# EAGLE design TinyGX (EAGLE 7.2.0)
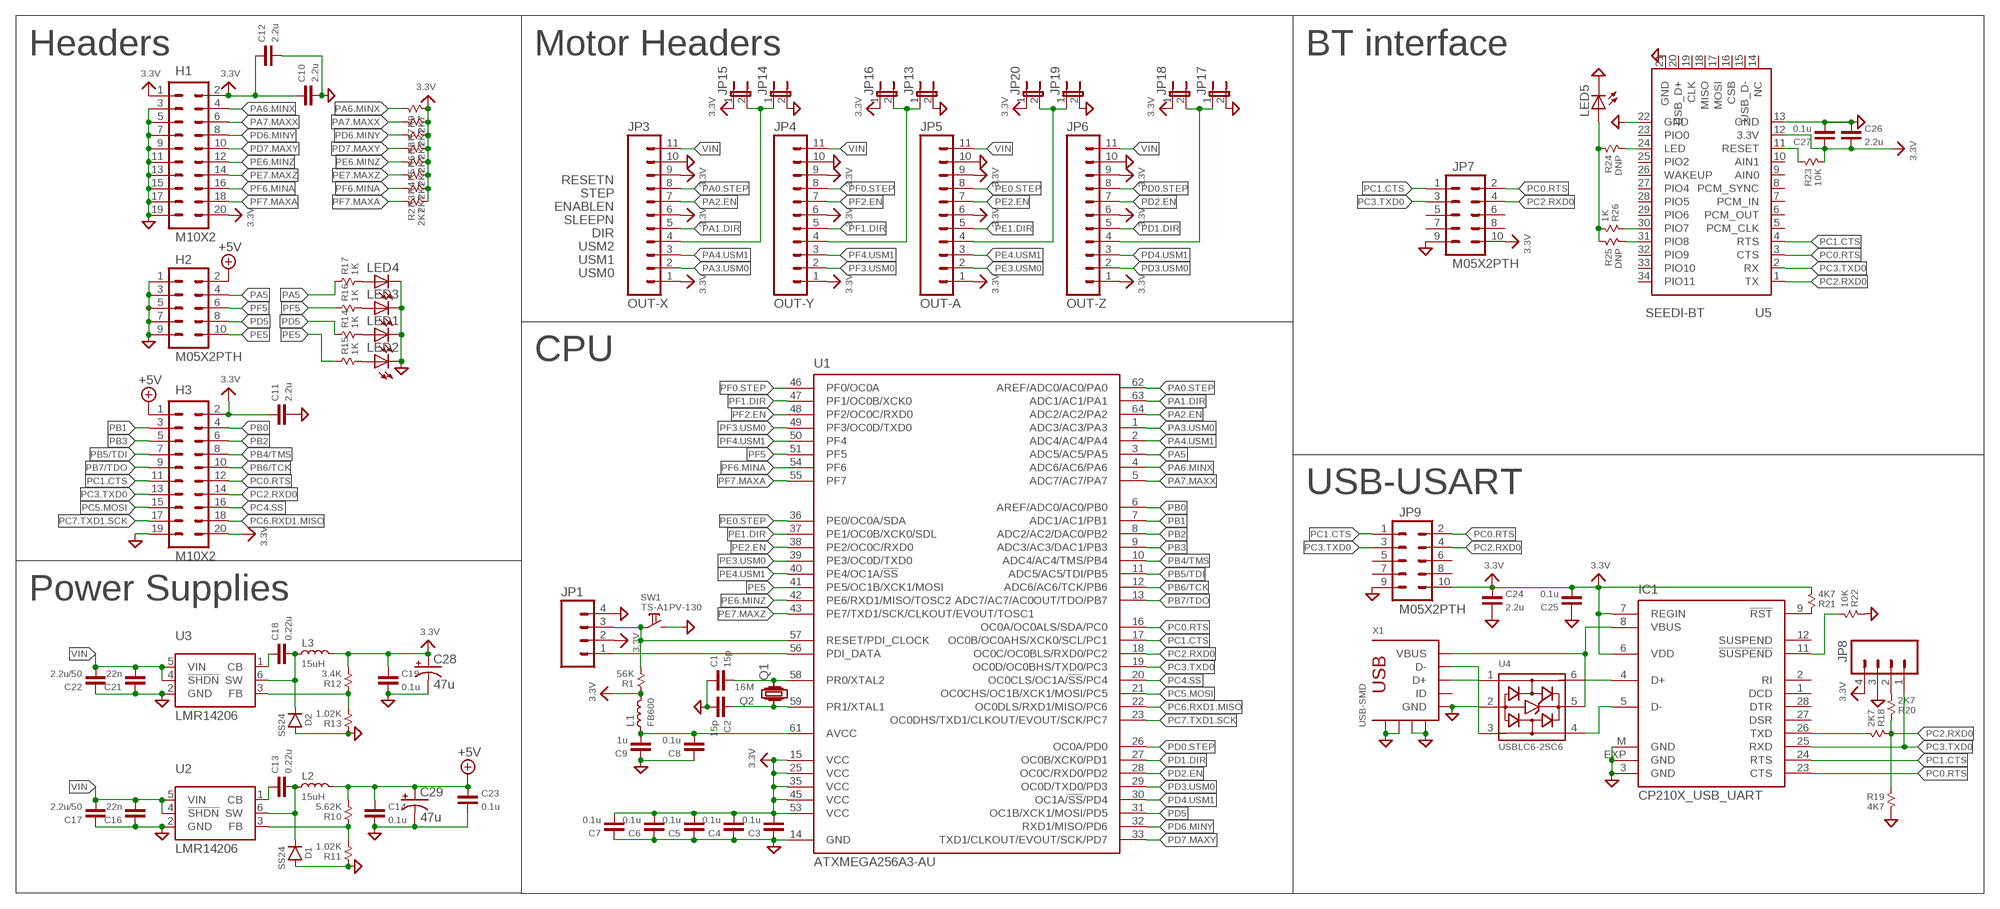
[diagram p0: schematic, sheet 1]

## Parts
C1  15p  CAP-0603  [0603]
C2  15p  CAP-0603  [0603]
C3  0.1u  CAP-0603  [0603]
C4  0.1u  CAP-0603  [0603]
C5  0.1u  CAP-0603  [0603]
C6  0.1u  CAP-0603  [0603]
C7  0.1u  CAP-0603  [0603]
C8  0.1u  CAP-0603  [0603]
C9  1u  CAP-0603  [0603]
C10  2.2u  CAP-0603  [0603]
C11  2.2u  CAP-0603  [0603]
C12  2.2u  CAP-0603  [0603]
C13  0.22u  CAP-0603  [0603]
C14  0.1u  CAP-0603  [0603]
C16  22n  CAP-0603  [0603]
C17  2.2u/50  CAP-1206  [1206]
C18  0.22u  CAP-0603  [0603]
C19  0.1u  CAP-0603  [0603]
C21  22n  CAP-0603  [0603]
C22  2.2u/50  CAP-1206  [1206]
C23  0.1u  CAP-0603  [0603]
C24  2.2u  CAP-0603  [0603]
C25  0.1u  CAP-0603  [0603]
C26  2.2u  CAP-0603  [0603]
C27  0.1u  CAP-0603  [0603]
C28  47u  CPOL-USCT3216  [CT3216]
C29  47u  CPOL-USCT3216  [CT3216]
D1  SS24  DIODE-SMA  [SMA]
D2  SS24  DIODE-SMA  [SMA]
H1  M10X2  [2X10]
H2  M05X2PTH  [AVR_ICSP]
H3  M10X2  [2X10]
IC1  CP210X_USB_UART  [MLP28]
JP1  M04PTH  [1X04]
JP3  OUT-X  M11PTH  [1X11]
JP4  OUT-Y  M11PTH  [1X11]
JP5  OUT-A  M11PTH  [1X11]
JP6  OUT-Z  M11PTH  [1X11]
JP7  M05X2PTH  [AVR_ICSP]
JP8  M04PTH  [1X04]
JP9  M05X2PTH  [AVR_ICSP]
JP13  JUMPER-2SMD-NO  [SJ_2S-NO]
JP14  JUMPER-2SMD-NO  [SJ_2S-NO]
JP15  JUMPER-2SMD-NO  [SJ_2S-NO]
JP16  JUMPER-2SMD-NO  [SJ_2S-NO]
JP17  JUMPER-2SMD-NO  [SJ_2S-NO]
JP18  JUMPER-2SMD-NO  [SJ_2S-NO]
JP19  JUMPER-2SMD-NO  [SJ_2S-NO]
JP20  JUMPER-2SMD-NO  [SJ_2S-NO]
L1  FB600  INDUCTOR-0603  [0603]
L2  15uH  INDUCTOR-CDRH73-  [CDRH73]
L3  15uH  INDUCTOR-CDRH73-  [CDRH73]
LED1  LEDCHIP-LED0603  [CHIP-LED0603]
LED2  LEDCHIP-LED0603  [CHIP-LED0603]
LED3  LEDCHIP-LED0603  [CHIP-LED0603]
LED4  LEDCHIP-LED0603  [CHIP-LED0603]
LED5  LEDCHIP-LED0603  [CHIP-LED0603]
Q1  CRYSTALHC49US  [HC49US]
Q2  16M  CRYSTAL-KX-KT  [KX-KT]
R1  56K  RESISTOR-0603  [0603]
R2  2K7  RESISTOR-0603  [0603]
R3  2K7  RESISTOR-0603  [0603]
R4  2K7  RESISTOR-0603  [0603]
R5  2K7  RESISTOR-0603  [0603]
R6  2K7  RESISTOR-0603  [0603]
R7  2K7  RESISTOR-0603  [0603]
R8  2K7  RESISTOR-0603  [0603]
R9  2K7  RESISTOR-0603  [0603]
R10  5.62K  RESISTOR-0603  [0603]
R11  1.02K  RESISTOR-0603  [0603]
R12  3.4K  RESISTOR-0603  [0603]
R13  1.02K  RESISTOR-0603  [0603]
R14  1K  RESISTOR-0603  [0603]
R15  1K  RESISTOR-0603  [0603]
R16  1K  RESISTOR-0603  [0603]
R17  1K  RESISTOR-0603  [0603]
R18  2K7  RESISTOR-0603  [0603]
R19  4K7  RESISTOR-0603  [0603]
R20  2K7  RESISTOR-0603  [0603]
R21  4K7  RESISTOR-0603  [0603]
R22  10K  RESISTOR-0603  [0603]
R23  10K  RESISTOR-0603  [0603]
R24  DNP  RESISTOR-0603  [0603]
R25  DNP  RESISTOR-0603  [0603]
R26  1K  RESISTOR-0603  [0603]
SW1  TS-A1PV-130  SWITCH-2-TS-A1PV-130  [TS-A1PV-130]
U1  ATXMEGA256A3-AU  [TQFP64-14X14]
U2  LMR14206  [SOT23-6]
U3  LMR14206  [SOT23-6]
U4  USBLC6-2SC6  [SOT23-6]
U5  SEEDI-BT  [SEEDI-BT]
X1  USB-SMD  [USB-MINIB]

## Nets
3.3V: C3.1 C4.1 C5.1 C6.1 C7.1 C10.2 C11.2 C12.2 C19.2 C24.2 C25.1 C26.1 C27.2 C28.+ H1.1 H1.2 H1.20 H3.2 H3.20 IC1.6(VDD) IC1.7(REGIN) JP1.2 JP3.1 JP3.6 JP3.9 JP4.1 JP4.6 JP4.9 JP5.1 JP5.6 JP5.9 JP6.1 JP6.6 JP6.9 JP7.10 JP8.4 JP9.10 JP15.1 JP16.1 JP18.1 JP20.1 L1.2 L3.P$2 R1.1 R2.2 R3.2 R4.2 R5.2 R6.2 R7.2 R8.2 R9.2 R12.2 R21.2 R23.2 U1.15(VCC) U1.25(VCC) U1.35(VCC) U1.45(VCC) U1.53(VCC) U5.12(3.3V)
+5V: C14.2 C23.2 C29.+ H2.2 H3.1 L2.P$2 R10.2
GND: C1.2 C2.1 C3.2 C4.2 C5.2 C6.2 C7.2 C8.2 C9.2 C10.1 C11.1 C12.1 C14.1 C16.2 C17.2 C19.1 C21.2 C22.2 C23.1 C24.1 C25.2 C26.2 C27.1 C28.- C29.- D1.P$2(A) D2.P$2(A) H1.3 H1.5 H1.7 H1.9 H1.11 H1.13 H1.15 H1.17 H1.19 H2.1 H2.3 H2.5 H2.7 H2.9 H3.19 IC1.3(GND) IC1.EXP(GND) IC1.M(GND) JP1.4 JP3.10 JP4.10 JP5.10 JP6.10 JP7.9 JP8.3 JP9.9 JP13.2 JP14.2 JP17.2 JP19.2 LED1.C LED2.C LED3.C LED4.C LED5.C R11.1 R13.1 R19.2 R22.1 SW1.2 U1.14(GND) U2.2(GND) U3.2(GND) U4.2(GND) U5.13(GND) U5.21(GND) U5.22(GND) X1.GND X1.GND@1(GND) X1.GND@2(GND) X1.GND@3(GND) X1.GND@4(GND)
N$1: C1.1 Q1.2 Q2.2 U1.58(PR0/XTAL2)
N$2: C2.2 Q1.1 Q2.1 U1.59(PR1/XTAL1)
N$3: R10.1 R11.2 U2.3(FB)
N$4: LED1.A R14.2
N$5: C13.1 D1.P$1(C) L2.P$1 U2.6(SW)
N$6: R12.1 R13.2 U3.3(FB)
N$7: C13.2 U2.1(CB)
N$8: C8.1 C9.1 L1.1 U1.61(AVCC)
N$9: C18.1 D2.P$1(C) L3.P$1 U3.6(SW)
N$10: C18.2 U3.1(CB)
N$11: LED2.A R15.2
N$12: LED3.A R16.2
N$13: LED4.A R17.2
N$14: IC1.5(D-) U4.4(IO2)
N$15: IC1.4(D+) U4.6(IO1)
N$16: IC1.8(VBUS) U4.5(VBUS) X1.VBUS
N$17: JP8.2 R20.2
N$18: IC1.26(TXD) R18.2
N$19: IC1.9(!RST) R21.1
N$20: U4.3(IO2) X1.D-
N$21: U4.1(IO1) X1.D+
N$22: IC1.11(!SUSPEND) R22.2
N$23: JP3.4 JP14.1 JP15.2
N$24: JP4.4 JP13.1 JP16.2
N$25: JP5.4 JP19.1 JP20.2
N$26: JP6.4 JP17.1 JP18.2
N$27: R26.1 U5.30(PIO7)
N$31: R23.1 U5.11(RESET)
N$32: R24.2 U5.24(LED)
N$33: R25.2 U5.31(PIO8)
N$34: LED5.A R24.1 R25.1 R26.2
PA0.STEP: JP3.8 U1.62(AREF/ADC0/AC0/PA0)
PA1.DIR: JP3.5 U1.63(ADC1/AC1/PA1)
PA2.EN: JP3.7 U1.64(ADC2/AC2/PA2)
PA3.USM0: JP3.2 U1.1(ADC3/AC3/PA3)
PA4.USM1: JP3.3 U1.2(ADC4/AC4/PA4)
PA5: H2.4 R17.1 U1.3(ADC5/AC5/PA5)
PA6.MINX: H1.4 R9.1 U1.4(ADC6/AC6/PA6)
PA7.MAXX: H1.6 R7.1 U1.5(ADC7/AC7/PA7)
PB0: H3.4 U1.6(AREF/ADC0/AC0/PB0)
PB1: H3.3 U1.7(ADC1/AC1/PB1)
PB2: H3.6 U1.8(ADC2/AC2/DAC0/PB2)
PB3: H3.5 U1.9(ADC3/AC3/DAC1/PB3)
PB4/TMS: H3.8 U1.10(ADC4/AC4/TMS/PB4)
PB5/TDI: H3.7 U1.11(ADC5/AC5/TDI/PB5)
PB6/TCK: H3.10 U1.12(ADC6/AC6/TCK/PB6)
PB7/TDO: H3.9 U1.13(ADC7/AC7/AC0OUT/TDO/PB7)
PC0.RTS: H3.12 IC1.23(CTS) JP7.2 JP9.2 U1.16(OC0A/OC0ALS/SDA/PC0) U5.3(CTS)
PC1.CTS: H3.11 IC1.24(RTS) JP7.1 JP9.1 U1.17(OC0B/OC0AHS/XCK0/SCL/PC1) U5.4(RTS)
PC2.RXD0: H3.14 JP7.4 JP9.4 R18.1 R19.1 R20.1 U1.18(OC0C/OC0BLS/RXD0/PC2) U5.1(TX)
PC3.TXD0: H3.13 IC1.25(RXD) JP7.3 JP8.1 JP9.3 U1.19(OC0D/OC0BHS/TXD0/PC3) U5.2(RX)
PC4.SS: H3.16 U1.20(OC0CLS/OC1A/!SS!/PC4)
PC5.MOSI: H3.15 U1.21(OC0CHS/OC1B/XCK1/MOSI/PC5)
PC6.RXD1.MISO: H3.18 U1.22(OC0DLS/RXD1/MISO/PC6)
PC7.TXD1.SCK: H3.17 U1.23(OC0DHS/TXD1/CLKOUT/EVOUT/SCK/PC7)
PD0.STEP: JP6.8 U1.26(OC0A/PD0)
PD1.DIR: JP6.5 U1.27(OC0B/XCK0/PD1)
PD2.EN: JP6.7 U1.28(OC0C/RXD0/PD2)
PD3.USM0: JP6.2 U1.29(OC0D/TXD0/PD3)
PD4.USM1: JP6.3 U1.30(OC1A/!SS!/PD4)
PD5: H2.8 R14.1 U1.31(OC1B/XCK1/MOSI/PD5)
PD6.MINY: H1.8 R8.1 U1.32(RXD1/MISO/PD6)
PD7.MAXY: H1.10 R6.1 U1.33(TXD1/CLKOUT/EVOUT/SCK/PD7)
PDI: JP1.1 U1.56(PDI_DATA)
PE0.STEP: JP5.8 U1.36(PE0/OC0A/SDA)
PE1.DIR: JP5.5 U1.37(PE1/OC0B/XCK0/SDL)
PE2.EN: JP5.7 U1.38(PE2/OC0C/RXD0)
PE3.USM0: JP5.2 U1.39(PE3/OC0D/TXD0)
PE4.USM1: JP5.3 U1.40(PE4/OC1A/!SS)
PE5: H2.10 R15.1 U1.41(PE5/OC1B/XCK1/MOSI)
PE6.MINZ: H1.12 R5.1 U1.42(PE6/RXD1/MISO/TOSC2)
PE7.MAXZ: H1.14 R4.1 U1.43(PE7/TXD1/SCK/CLKOUT/EVOUT/TOSC1)
PF0.STEP: JP4.8 U1.46(PF0/OC0A)
PF1.DIR: JP4.5 U1.47(PF1/OC0B/XCK0)
PF2.EN: JP4.7 U1.48(PF2/OC0C/RXD0)
PF3.USM0: JP4.2 U1.49(PF3/OC0D/TXD0)
PF4.USM1: JP4.3 U1.50(PF4)
PF5: H2.6 R16.1 U1.51(PF5)
PF6.MINA: H1.16 R3.1 U1.54(PF6)
PF7.MAXA: H1.18 R2.1 U1.55(PF7)
RST/PDC: JP1.3 R1.2 SW1.1 U1.57(RESET/PDI_CLOCK)
VIN: C16.1 C17.1 C21.1 C22.1 JP3.11 JP4.11 JP5.11 JP6.11 U2.4(!SHDN) U2.5(VIN) U3.4(!SHDN) U3.5(VIN)
Unconnected: IC1.1(DCD) IC1.2(RI) IC1.12(SUSPEND) IC1.27(DSR) IC1.28(DTR) JP7.5 JP7.6 JP7.7 JP7.8 JP9.5 JP9.6 JP9.7 JP9.8 U5.5(PCM_CLK) U5.6(PCM_OUT) U5.7(PCM_IN) U5.8(PCM_SYNC) U5.9(AIN0) U5.10(AIN1) U5.14(NC) U5.15(USB_D-) U5.16(CSB) U5.17(MOSI) U5.18(MISO) U5.19(CLK) U5.20(USB_D+) U5.23(PIO0) U5.25(PIO2) U5.26(WAKEUP) U5.27(PIO4) U5.28(PIO5) U5.29(PIO6) U5.32(PIO9) U5.33(PIO10) U5.34(PIO11) X1.ID

## Notes on the sheet
- Headers | Motor Headers | BT interface
- RESETN
- STEP
- ENABLEN
- SLEEPN
- DIR
- USM2
- USM1
- USM0
- CPU
- USB-USART
- Power Supplies

## Power pins joined to a net without a drawn wire
GND: U1.24(GND) U1.34(GND) U1.44(GND) U1.52(GND) U1.60(GND)

## Library data of the parts
C1-C14 C16-C19 C21-C27 = X893:CAP: Capacitor
C28 C29 = adafruit:CPOL-US: POLARIZED CAPACITOR, American symbol
D1 D2 = X893:DIODE
H1 H3 = SparkFun:M10X2: This was SPECIALLY designed to be used with our Graphic LCD Backpack. Be sure you want to use this! It is not only staggered on each line of header holes, but IT IS ALSO offset of the center point of the top and bottom lines by 5 mil. This causes the headers to lock into place on the "standard" footprint on the LCD screen. The extra squares on the tdocu layer are there simply to reference other pins (if you were to actually populate a longer header than ten long - this is what we do with the backpacks).
H2 JP7 JP9 = SparkFun:M05X2: Header 5x2 Standard 10-pin dual row 0.1" header. Commonly used with AVR-ISP. Use with Spark Fun Electronics SKU: PRT-00778
IC1 = SparkFun:CP210X_USB_UART: Single-Chip USB to UART Bridge Source: www.silabs.com .. CP2101.pdf / cp2102.pdf. Spark Fun Electronics SKU : COM-00310
JP1 JP8 = SparkFun:M04: Header 4 Standard 4-pin 0.1" header. Use with straight break away headers (SKU : PRT-00116), right angle break away headers (PRT-00553), swiss pins (PRT-00743), machine pins (PRT-00117), and female headers (PRT-00115). Molex polarized connector foot print use with SKU : PRT-08231 with associated crimp pins and housings.
JP3-JP6 = SparkFun:M11: Header 11 Standard 11-pin 0.1" header. Use with straight break away headers (SKU : PRT-00116), right angle break away headers (PRT-00553), swiss pins (PRT-00743), machine pins (PRT-00117), and female headers (PRT-00115).
JP13-JP20 = SparkFun:JUMPER-2: Jumper Basic 0.1" spaced jumper. Use with breakaway headers.
L1-L3 = X893:INDUCTOR: http://www.murata.com/products/catalog/pdf/o05e.pdf
LED1-LED5 = led:LED: LED OSRAM: - CHIPLED LG R971, LG N971, LY N971, LG Q971, LY Q971, LO R971, LY R971 LH N974, LH R974 LS Q976, LO Q976, LY Q976 LO Q996 - Hyper CHIPLED LW Q18S LB Q993, LB Q99A, LB R99A - SideLED LS A670, LO A670, LY A670, LG A670, LP A670 LB A673, LV A673, LT A673, LW A673 LH A674 LY A675 LS A676, LA A676, LO A676, LY A676, LW A676 LS A679, LY A679, LG A679 - Hyper Micro SIDELED® LS Y876, LA Y876, LO Y876, LY Y876 LT Y87S - SmartLED LW L88C, LW L88S LB L89C, LB L89S, LG L890 LS L89K, LO L89K, LY L89K LS L896, LA L896, LO L896, LY L896 - TOPLED LS T670, LO T670, LY T670, LG T670, LP T670 LSG T670, LSP T670, LSY T670, LOP T670, LYG T670 LG T671, LOG T671, LSG T671 LB T673, LV T673, LT T673, LW T673 LH T674 LS T676, LA T676, LO T676, LY T676, LB T676, LH T676, LSB T676, LW T676 LB T67C, LV T67C, LT T67C, LS T67K, LO T67K, LY T67K, LW E67C LS E67B, LA E67B, LO E67B, LY E67B, LB E67C, LV E67C, LT E67C LW T67C LS T679, LY T679, LG T679 LS T770, LO T770, LY T770, LG T770, LP T770 LB T773, LV T773, LT T773, LW T773 LH T774 LS E675, LA E675, LY E675, LS T675 LS T776, LA T776, LO T776, LY T776, LB T776 LHGB T686 LT T68C, LB T68C - Hyper Mini TOPLED® LB M676 - Mini TOPLED Santana® LG M470 LS M47K, LO M47K, LY M47K Source: http://www.osram.convergy.de LUXEON: - LUMILED® LXK2-PW12-R00, LXK2-PW12-S00, LXK2-PW14-U00, LXK2-PW14-V00 LXK2-PM12-R00, LXK2-PM12-S00, LXK2-PM14-U00 LXK2-PE12-Q00, LXK2-PE12-R00, LXK2-PE12-S00, LXK2-PE14-T00, LXK2-PE14-U00 LXK2-PB12-K00, LXK2-PB12-L00, LXK2-PB12-M00, LXK2-PB14-N00, LXK2-PB14-P00, LXK2-PB14-Q00 LXK2-PR12-L00, LXK2-PR12-M00, LXK2-PR14-Q00, LXK2-PR14-R00 LXK2-PD12-Q00, LXK2-PD12-R00, LXK2-PD12-S00 LXK2-PH12-R00, LXK2-PH12-S00 LXK2-PL12-P00, LXK2-PL12-Q00, LXK2-PL12-R00 Source: www.luxeon.com KINGBRIGHT: KA-3528ASYC Source: www.kingbright.com
Q1 = SparkFun:CRYSTAL: Crystals Various standard crystals. Proven footprints. Spark Fun Electronics SKU : COM-00534
Q2 = X893:CRYSTAL: Crystal
R1-R26 = X893:RESISTOR
SW1 = X893:SWITCH-2: KSR http://www.farnell.com/datasheets/320571.pdf
U1 = X893:ATXMEGA
U2 U3 = X893:LMR14206: SIMPLE SWITCHER 42Vin, 0.6A Step-Down Voltage Regulator in SOT-23 www.ti.com/lit/ds/symlink/lmr14206.pdf
U4 = X893:USBLC6: USBLC6-2SC6 <http://www.terraelectronica.ru/pdf/ST/USBLC6-2SC6.pdf>
U5 = X893:SEEDI-BT: Serial port bluetooth module http://www.seeedstudio.com/depot/serial-port-bluetooth-module-masterslave-p-572.html?cPath=2
X1 = X893:USB: USB Connectors USB-B-PTH is fully proven SKU : PRT-00139 USB-miniB is fully proven SKU : PRT-00587 USB-A-PCB is untested. USB-A-H is throughly reviewed, but untested. Spark Fun Electronics SKU : PRT-00437 USB-B-SMT is throughly reviewed, but untested. Needs silkscreen touching up. USB-A-S has not been used/tested USB-MB-H has not been used/tested

## Board
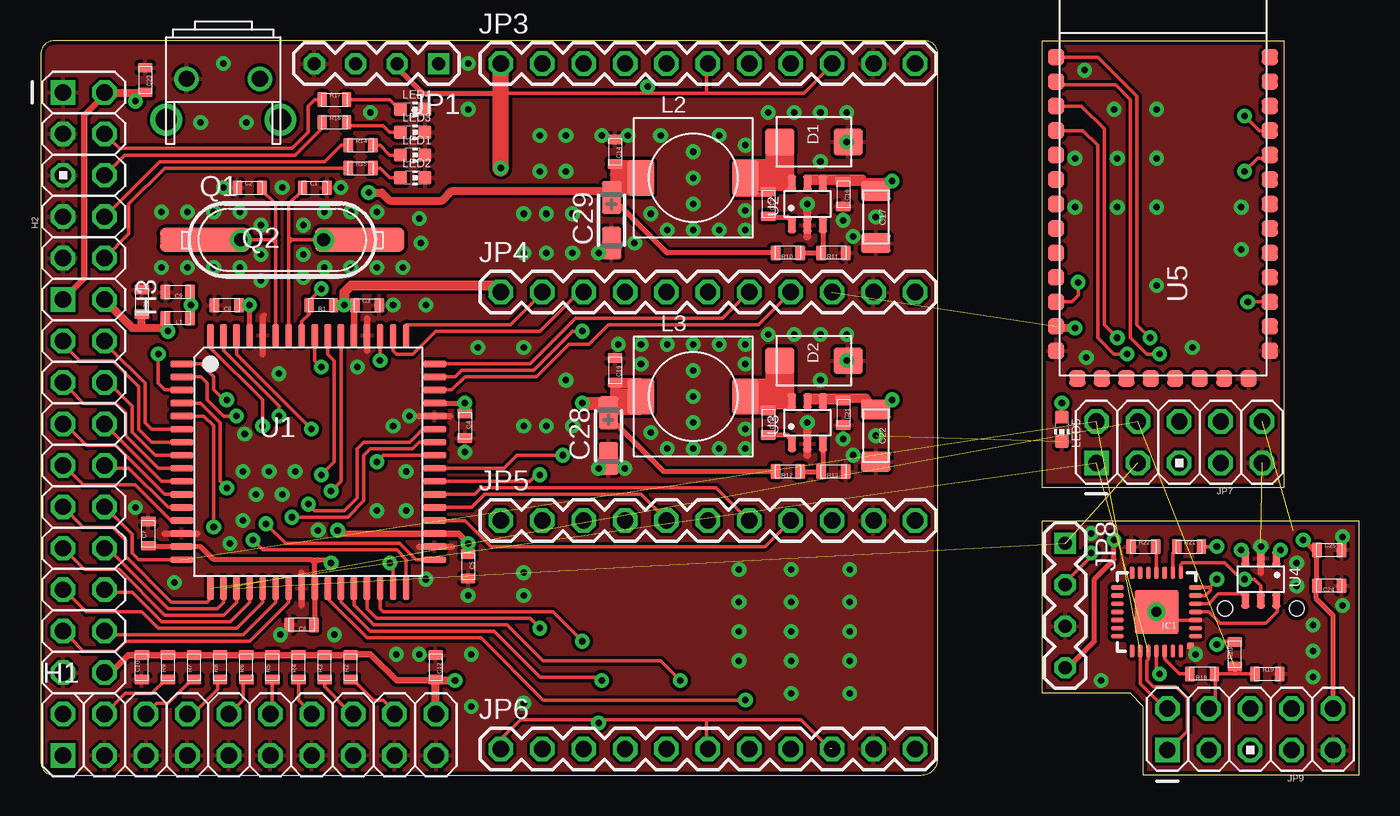
[diagram p1: board, top side]
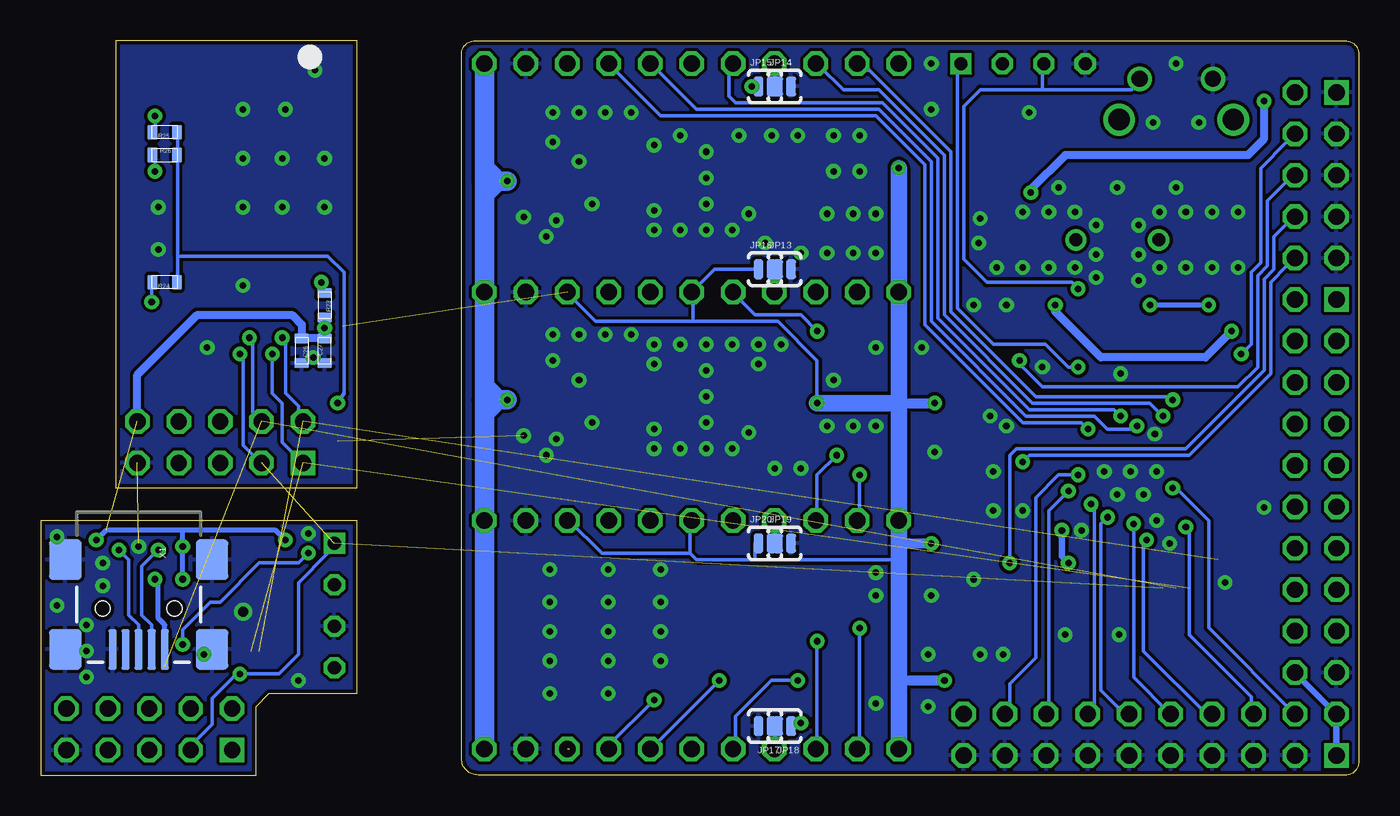
[diagram p2: board, bottom side, seen from below]

Size 80.8 x 45 mm. Coordinates in mm from the lower left corner, seen from the top.
Outline: 0,0.8 arc90 0.8,0 54,0 arc90 55,1 55,44.2 arc90 54.2,45 0.8,45 arc90 0,44.2 0,0.8
Outline: 80.8,0 67.6,0 67.6,4.2 66.8,5 61.4,5 61.4,15.6 80.8,15.6 80.8,0
Outline: 76.2,17.6 61.4,17.6 61.4,45 76.2,45 76.2,17.6
Copper layers (1+16): Top 0.035mm / dielectric 1.5mm / Bottom 0.035mm
Design rules "Rezonit": minimum track width 0.2mm, minimum drill 0.4mm, track to track 0.2mm, track to pad 0.2mm, pad to pad 0.2mm, via to via 0.2mm, smd to smd 0mil, copper to edge 0.25mm, drill to drill 0.4mm, minimum pad ring 0.25mm, minimum via ring 0.25mm, stop-mask expansion 4mil, vias tented up to drill 0.4mm, thermal gap 0.2mm

### Footprints (pad centres in the part's own frame; a part is rotated, then mirrored left to right if it is on the bottom)
0603 = smd 0.6 x 0.9: 1 -0.75,0; 2 0.75,0
1206 = smd 1.2 x 1.8: 1 -1.6,0; 2 1.6,0
CT3216 = smd 2 x 1.2: + 1.4,0; - -1.4,0
SMA = smd 1.8 x 1.65: P$1 2.1,0; P$2 -2.1,0
2X10 = drill 1 pad 1.5 square: 1 -11.43,-1.27 | drill 1 pad 1.5 octagon: 2 -11.43,1.27; 3 -8.89,-1.27; 4 -8.89,1.27; 5 -6.35,-1.27; 6 -6.35,1.27; 7 -3.81,-1.27; 8 -3.81,1.27; 9 -1.27,-1.27; 10 -1.27,1.27; 11 1.27,-1.27; 12 1.27,1.27; 13 3.81,-1.27; 14 3.81,1.27; 15 6.35,-1.27; 16 6.35,1.27; 17 8.89,-1.27; 18 8.89,1.27; 19 11.43,-1.27; 20 11.43,1.27
AVR_ICSP = drill 1 pad 1.5 square: 1 -1.27,5.08 | drill 1 pad 1.5 octagon: 2 1.27,5.08; 3 -1.27,2.54; 4 1.27,2.54; 5 -1.27,0; 6 1.27,0; 7 -1.27,-2.54; 8 1.27,-2.54; 9 -1.27,-5.08; 10 1.27,-5.08
MLP28 = smd 0.8 x 0.3: 1 -2.4,1.5; 2 -2.4,1; 3 -2.4,0.5; 4 -2.4,0; 5 -2.4,-0.5; 6 -2.4,-1; 7 -2.4,-1.5; 15 2.4,-1.5; 16 2.4,-1; 17 2.4,-0.5; 18 2.4,0; 19 2.4,0.5; 20 2.4,1; 21 2.4,1.5 | smd 0.3 x 0.8: 8 -1.5,-2.4; 9 -1,-2.4; 10 -0.5,-2.4; 11 0,-2.4; 12 0.5,-2.4; 13 1,-2.4; 14 1.5,-2.4; 22 1.5,2.4; 23 1,2.4; 24 0.5,2.4; 25 0,2.4; 26 -0.5,2.4; 27 -1,2.4; 28 -1.5,2.4 | smd 2.7 x 2.7: EXP 0,0 | smd 0.435 x 0.435: M -2.103,2.103
1X04 = drill 0.8 pad 1.3 square: 1 0,0 | drill 0.8 pad 1.3 octagon: 2 2.54,0; 3 5.08,0; 4 7.62,0
1X11 = drill 1 pad 1.5 octagon: 1 0,0; 2 2.54,0; 3 5.08,0; 4 7.62,0; 5 10.16,0; 6 12.7,0; 7 15.24,0; 8 17.78,0; 9 20.32,0; 10 22.86,0; 11 25.4,0
SJ_2S-NO = smd 0.6 x 1.2: 1 -0.4,0; 2 0.4,0
CDRH73 = smd 2.2 x 1.6: P$1 0,3.2; P$2 0,-3.2
CHIP-LED0603 = smd 0.8 x 0.8: A 0,-0.75; C 0,0.75
HC49US = drill 0.813: 1 -2.54,0; 2 2.54,0
KX-KT = smd 5.5 x 1.5: 1 -4.75,0; 2 4.75,0
TS-A1PV-130 = drill 1: 1 -2.25,0; 2 2.25,0 | drill 1.3: GND@1 3.5,2.5; GND@2 -3.5,2.5
TQFP64-14X14 = smd 1.4 x 0.4: 1 -7.75,6; 2 -7.75,5.2; 3 -7.75,4.4; 4 -7.75,3.6; 5 -7.75,2.8; 6 -7.75,2; 7 -7.75,1.2; 8 -7.75,0.4; 9 -7.75,-0.4; 10 -7.75,-1.2; 11 -7.75,-2; 12 -7.75,-2.8; 13 -7.75,-3.6; 14 -7.75,-4.4; 15 -7.75,-5.2; 16 -7.75,-6; 33 7.75,-6; 34 7.75,-5.2; 35 7.75,-4.4; 36 7.75,-3.6; 37 7.75,-2.8; 38 7.75,-2; 39 7.75,-1.2; 40 7.75,-0.4; 41 7.75,0.4; 42 7.75,1.2; 43 7.75,2; 44 7.75,2.8; 45 7.75,3.6; 46 7.75,4.4; 47 7.75,5.2; 48 7.75,6 | smd 0.4 x 1.4: 17 -6,-7.75; 18 -5.2,-7.75; 19 -4.4,-7.75; 20 -3.6,-7.75; 21 -2.8,-7.75; 22 -2,-7.75; 23 -1.2,-7.75; 24 -0.4,-7.75; 25 0.4,-7.75; 26 1.2,-7.75; 27 2,-7.75; 28 2.8,-7.75; 29 3.6,-7.75; 30 4.4,-7.75; 31 5.2,-7.75; 32 6,-7.75; 49 6,7.75; 50 5.2,7.75; 51 4.4,7.75; 52 3.6,7.75; 53 2.8,7.75; 54 2,7.75; 55 1.2,7.75; 56 0.4,7.75; 57 -0.4,7.75; 58 -1.2,7.75; 59 -2,7.75; 60 -2.8,7.75; 61 -3.6,7.75; 62 -4.4,7.75; 63 -5.2,7.75; 64 -6,7.75
SOT23-6 = smd 1 x 0.5: 1 -1.3,0.95; 2 -1.3,0; 3 -1.3,-0.95; 4 1.3,-0.95; 5 1.3,0; 6 1.3,0.95
SEEDI-BT = smd 1 x 1: 1 -6.55,6; 2 -6.55,4.5; 3 -6.55,3; 4 -6.55,1.5; 5 -6.55,0; 6 -6.55,-1.5; 7 -6.55,-3; 8 -6.55,-4.5; 9 -6.55,-6; 10 -6.55,-7.5; 11 -6.55,-9; 12 -6.55,-10.5; 13 -6.55,-12; 14 -5.25,-13.7; 15 -3.75,-13.7; 16 -2.25,-13.7; 17 -0.75,-13.7; 18 0.75,-13.7; 19 2.25,-13.7; 20 3.75,-13.7; 21 5.25,-13.7; 22 6.55,-12; 23 6.55,-10.5; 24 6.55,-9; 25 6.55,-7.5; 26 6.55,-6; 27 6.55,-4.5; 28 6.55,-3; 29 6.55,-1.5; 30 6.55,0; 31 6.55,1.5; 32 6.55,3; 33 6.55,4.5; 34 6.55,6
USB-MINIB = smd 2.5 x 0.5: D+ 2.5,0; D- 2.5,0.8; GND 2.5,-1.6; ID 2.5,-0.8; VBUS 2.5,1.6 | smd 2.5 x 2: GND@1 -3,-4.5; GND@2 -3,4.5; GND@3 2.5,4.5; GND@4 2.5,-4.5 | hole 0.9: 0,2.2; 0,-2.2

### Placement (x,y rotation side)
C1  16.8,36 0 top
C2  12.8,36 0 top
C3  20,28.8 0 top
C4  26,21.4 270 top
C5  26.2,12.8 270 top
C6  16,9.2 180 top
C7  6.6,14.8 90 top
C8  11.4,28.8 180 top
C9  8.4,29.6 180 top
C10  6.2,6.6 90 top
C11  6.2,29 270 top
C12  24.2,6.6 270 top
C13  44.6,35 270 top
C14  35.2,38.2 270 top
C16  49.2,35.6 270 top
C17  51.2,34.2 270 top
C18  44.6,21.6 270 top
C19  35.2,24.8 270 top
C21  49.2,22.2 270 top
C22  51.2,20.8 270 top
C23  6.4,42.6 270 top
C24  79,11.6 180 top
C25  79,13.8 0 top
C26  64.8,26 270 bottom
C27  63.4,26 90 bottom
C28  34.8,20.8 90 top
C29  35,34 90 top
D1  47.4,38.8 180 top
D2  47.4,25.4 180 top
H1  12.8,2.47 0 top
H2  2.64,36.76 0 top
H3  2.64,17.71 270 top
IC1  68.4,10 180 top
JP1  24.39,43.6 180 top
JP3  28.2,43.6 0 top
JP4  28.2,29.6 0 top
JP5  28.2,15.6 0 top
JP6  28.2,1.6 0 top
JP7  69.8,20.4 90 top
JP8  62.8,14.2 270 top
JP9  74.15,2.8 90 top
JP13  35.2,31 0 bottom
JP14  35.2,42.2 0 bottom
JP15  36.4,42.2 0 bottom
JP16  36.4,31 0 bottom
JP17  36.4,3 180 bottom
JP18  35.2,3 180 bottom
JP19  35.2,14.2 0 bottom
JP20  36.4,14.2 0 bottom
L1  8.4,28 180 top
L2  40,36.6 270 top
L3  40,23.2 270 top
LED1  22.8,38 270 top
LED2  22.8,36.6 270 top
LED3  22.8,39.4 270 top
LED4  22.8,40.8 270 top
LED5  62.6,21.2 180 top
Q1  14.8,32.8 0 top
Q2  14.8,32.8 0 top
R1  17.2,28.8 180 top
R2  19,6.6 90 top
R3  17.4,6.6 90 top
R4  15.8,6.6 90 top
R5  14.2,6.6 90 top
R6  12.6,6.6 90 top
R7  9.4,6.6 90 top
R8  11,6.6 90 top
R9  7.8,6.6 90 top
R10  45.8,32 180 top
R11  48.6,32 180 top
R12  45.8,18.6 180 top
R13  48.6,18.6 180 top
R14  19.6,38.6 0 top
R15  19.6,37.2 0 top
R16  18,40 0 top
R17  18,41.4 0 top
R18  71.2,6.2 180 top
R19  75.2,6.2 0 top
R20  73.2,7.4 90 top
R21  70.4,14 0 top
R22  67.6,14 0 top
R23  63.4,28.8 270 bottom
R24  73.2,30.2 180 bottom
R25  73.2,39.4 180 bottom
R26  73.2,38 0 bottom
SW1  11.19,42.67 180 top
U1  16.4,19.2 0 top
U2  47,35 90 top
U3  47,21.6 90 top
U4  74.8,12 270 top
U5  68.8,38 0 top
X1  74.8,10.2 270 bottom

### Tracks (layer width: path | path; a pad name or v marks a point on that pad's centre or on a via)
3.3V  (via drill 0.4)  (3 unrouted)
  Top 0.2: R1.1 v18.6,28.8 C3.1 | 40.8,41.8 46.8,41.8 48.18,43.18 48.18,43.26 JP3.9 | 40.8,41.8 37.2,41.8 | 37.2,41.8 28.2,41.8 | 40.8,41.8 40.8,43.5 JP3.6 | 48.38,1.62 46.6,3.4 40.8,3.4 | 40.8,3.4 34.2,3.4 | 34.2,3.4 29.4,3.4 28.2,2.2 JP6.1 | 40.8,3.4 40.8,1.8 40.9,1.7 JP6.6 | 7.6,28 7.6,27.4 | IC1.6 71.4,11 71.7,11.3 71.7,11.5 | IC1.7 71.7,11.5 | 71.7,11.5 v72.1,12 | R21.2 v72.1,14 | 35,22.2 C28.+ | v37.2,42.2 37.2,41.8 | v34.2,3.2 34.2,3.4
  Top 0.3: U1.45 v26,22.8 C4.1 | C6.1 16.8,9.2 U1.25 16.8,13 | 6.6,14 U1.15 9.8,14 10.6,13.2 16.6,13.2 | 16.8,13 16.6,13.2 | 16.8,13 17,13.2 | 16.6,13.2 17.6,13.2 v17.8,13 | C11.2 6.2,28.2 | L1.2 7.6,28 | R12.2 38.2,18.6 35.2,21.6 35.2,22 35,22.2 | JP1.2 21.85,43.35 23.4,41.8 28.2,41.8 | JP9.10 79.23,9.77 78.2,10.8 78.2,11.6 | C24.2 78.2,11.6 | C25.1 78.2,13.8 | 78.2,13.8 78.2,11.6 | 78.2,13.8 78,13.8 v77.4,14.4 | JP8.4 63.01,6.61 64.6,8.2 64.6,12 65.8,13.2 v65.8,14.4
  Top 0.4: C5.1 v26.2,14.2 25.6,14.8 U1.35 18.4,14.8 v18.2,15 | 6.6,14 C7.1 | H3.20 4.03,6.4 4.4,6.4 5.35,7.35 C10.2 R9.2 R7.2 R8.2 R6.2 R5.2 R4.2 R3.2 R2.2 19,7.4 20.2,7.4 21.8,5.8 24.2,5.8 | U1.53 19.2,28.75 C3.1
  Top 0.5: H1.20 24.23,3.83 24.2,4.1 24.2,5.8 v25.4,5.8 | H3.2 3.91,29.09 5.6,27.4 6.2,27.4 | 6.2,27.4 C11.2 | 6.2,27.4 7.6,27.4 v7.8,27.2 | U5.12 62.3,27.5 62.4,27.4 v63.4,27.4
  Top 0.6: JP4.1 28.2,30 19,30 18.6,29.6 v18.6,28.8 | C12.2 24.2,5.8 | C19.2 35.2,24 | 35.2,24 35.2,23.4 | 35.2,23.4 35.2,22.8 | 35.2,22.8 35.2,22.4 36.8,22.4 L3.P$2 | L3.P$2 36.8,24 35.2,24 | 35.2,23.4 36.8,23.4 L3.P$2 | 35.2,22.8 36.4,22.8
  Top 0.8: v33.2,22.8 34.8,22.8 | 34.8,22.8 35.2,22.8 | C28.+ 34.8,22.8
  Top 1: JP3.1 28.2,41.8 v28.2,37.2
  Bottom 0.2: 40.8,27.8 46.8,27.8 48.52,29.52 JP4.9 | 40.8,27.8 35.6,27.8 33.2,25.4 v33.2,22.8 | 40.8,27.8 40.8,29.4 40.9,29.5 JP4.6 39.5,31 JP16.1 | 41,13.6 46.4,13.6 48.4,15.6 JP5.9 | 41,13.6 40.6,13.2 37,13.2 | 37,13.2 28.2,13.2 | 41,13.6 41,15.5 JP5.6 | JP15.1 v37.2,42.2 | JP20.1 37,14.2 37,13.2 | JP18.1 34.6,3 34.6,3.2 v34.2,3.2
  Bottom 0.3: v72.1,12 v72.1,14 72.1,14.9 72,15 | v77.4,14.4 76.8,15 72,15 | v65.8,14.4 66.4,15 72,15
  Bottom 0.4: 4,6.37 H3.20 H1.2 H1.1 | v18.2,15 18.2,13.4 v17.8,13
  Bottom 0.5: v7.8,27.2 9.4,25.6 15.8,25.6 18.6,28.4 v18.6,28.8 | R23.2 v63.4,27.4 C27.2 63.25,26.8 64.8,26.8 C26.1 64.8,27.6 65.4,28.2 71.2,28.2 74.88,24.52 JP7.10
  Bottom 0.6: 28.2,22.8 v26,22.8 | 28.2,5.8 v25.4,5.8 | 28.2,14.2 v26.2,14.2
  Bottom 1: 28.2,22.8 JP4.1 v28.2,37.2 | 28.2,22.8 JP5.1 28.2,14.2 28.2,13.2 28.2,5.8 JP6.1 | 28.2,22.8 v33.2,22.8
+5V  (via drill 0.4)
  Top 0.2: 35.2,35.2 35,35.2 C29.+
  Top 0.3: R10.2 38.4,32 35.2,35.2
  Top 0.4: H3.1 1.37,29.17 2.65,30.45 2.65,40.45 3.6,41.4 3.6,41.53 H2.2
  Top 0.5: v5.8,41.3 5.8,41.8 | v20.1,35.7 20.9,35.7 21.4,35.2 24.6,35.2 25.2,35.8 35,35.8 35,35.7 | C23.2 6.4,41.8 5.8,41.8 | 5.8,41.8 3.95,41.8 H2.2
  Top 0.6: 35,35.7 C29.+ 35,36 35.2,36 | C14.2 35.2,37.4 | 35.2,37.4 35.2,36.8 | 35.2,36.2 35.2,36 | L2.P$2 36.8,35.8 35.2,35.8 35.2,36 | 35.2,37.4 36.4,37.4 36.4,36.8 35.2,36.8 | 35.2,36.8 35.2,36.2 | 35.2,36.2 36.4,36.2
  Bottom 0.5: v5.8,41.3 5.8,39 6.8,38 18,38 20.1,35.9 v20.1,35.7
GND  (via drill 0.4, 0.6)  (2 unrouted)
  Top 0.2: IC1.3 68.9,9.5 IC1.EXP
  Top 0.3: 13.7,28.2 13.6,28.1
  Top 0.4: 13.6,28.1 13.6,25.8 | 7.6,14.8 9.6,14.8 | 16,10.4 16,12.4 | 25.2,14 23.2,14 | 25.1,22 23.2,22 | 20,28 20,26 | 74.8,12.4 74.8,14.2
  Top 0.5: 47,33 v47,35 | 47,19.6 v47,21.6
  other vias: 13.5,33.7 16.1,33.7 13.5,31.9 16.1,31.9 5.8,16.4 18,8.6 8.2,11.8 21.8,7.4 23.2,7.4 26.4,7.4 26.4,4.2 14.6,24.6 16.1,30.5 13.5,30.3 19.4,25 22.6,22 22.4,18.6 14.7,8.6 19,31.1 20.6,31.1 22.2,31.1 23.3,32.6 17.4,31.1 23.2,34.1 20.6,34.5 19,34.5 17.4,34.5 12.2,31.1 10.6,31.1 9,31.1 7.4,31.1 12.2,34.5 10.6,34.5 9,34.5 7.4,34.5 14.8,36 18.4,36 11.2,36 22.4,16.2 12.4,15.6 12.4,18.6 14,18.6 15.6,18.6 13.2,17.2 14.8,17.2 20.6,16.2 17,15 23.6,12 21.6,21.4 12.5,20.9 29.6,4.4 23.6,28.8 40,36.6 40,35 40,33.4 40,38.2 38,39.2 41.6,39.2 43.2,33.4 41.6,33.4 38.4,33.4 37.4,34.4 44.6,40.6 46.2,40.6 47.8,40.6 49.4,40.6 49.4,38.8 47.8,37.6 26.2,40.8 32.6,34.4 31,34.4 29.6,34.4 34.2,32 32.6,32 31,32 29.6,32 34.4,39.2 32.2,39.2 30.6,39.2 30.6,37 32.2,37 26.8,26.2 29.6,26.2 43.2,20 41.6,20 40,20 40,23.2 40,21.6 40,24.8 40,26.4 43.2,26.4 41.6,26.4 38.4,26.4 36.8,26.4 35.4,26.4 38.4,20 37.4,21 47.8,24.2 44.6,27 46.2,27 47.8,27 49.4,27 49.4,25.4 49.8,33 49.2,34 49.2,20.6 49.8,19.6 35.8,18.8 34.2,18.8 29.6,21.4 31,21.4 32.6,21.4 32.2,24.2 26,19.8 26.2,11 29.6,11 29.6,12.4 49.6,12.6 46,5 49.6,10.6 49.6,8.8 49.6,7 49.6,5 46,7 46,8.8 46,10.6 46,12.6 42.8,12.6 42.8,10.6 42.8,8.8 42.8,7 11.6,14.2 21.6,28.8 26.2,43.6 9.8,40 12.6,40 11.2,43.6 43.2,21.2 43.2,25.2 36.8,25.2 43.2,38.6 43.2,34.6 36,39.2 68.4,10 78,6 78,7.6 78,9.2 79.8,10.4 79.8,14.6 70.8,7.4 65,5.8 77,11.6 74.8,14 64.4,14.8 77,13 64.1,25.6 65.8,40.8 66,34.8 68.4,30 68.4,34.8 68.4,40.8 63.4,34.8 63.4,37.8 66,37.8 68.4,37.8 70.6,26.2 51.2,20.8 51.2,34.2 64,43.2 36.4,32.6 20.2,40.6 73.6,34.8 73.6,32.2
  pour Top: 0,0 55,0 55,45 0,45
  pour Bottom: 0,0 55,0 55,45 0,45
  pour Top: 80.8,0 67.6,0 67.6,4.2 66.8,5 61.4,5 61.4,15.6 80.8,15.6
  pour Bottom: 80.8,0 67.6,0 67.6,4.2 66.8,5 61.4,5 61.4,15.6 80.8,15.6
  pour Bottom: 76.2,17.6 61.4,17.6 61.4,45 76.2,45
  pour Top: 76.2,17.6 61.4,17.6 61.4,45 76.2,45
N$1
  Top 0.2: U1.58 15.2,32.6 | 15.2,32.6 15.2,33 | 15.2,33 15.2,35 16.05,35.85 C1.1 | Q1.2 15.4,32.8 | 15.2,33 15.4,32.8 | 15.4,32.8 15.2,32.6
  Top 0.3: Q2.2 Q1.2
N$2
  Top 0.2: U1.59 14.4,32.6 | 14.4,32.6 14.4,33 | 14.4,33 14.4,35 13.55,35.85 C2.2 | Q1.1 14.2,32.8 | 14.2,32.8 14.4,33 | 14.2,32.8 14.4,32.6
  Top 0.3: Q2.1 Q1.1
N$3
  Top 0.3: R10.1 R11.2 47.95,32.1 U2.3
N$4
  Top 0.2: LED1.A 21.4,38 20.8,38.6 R14.2
N$5
  Top 0.2: 44.6,36 C13.1
  Top 0.3: 44.6,37.6 42.6,37.6 42.6,35.6 44.8,35.6 C13.1 | 44.8,36 44.8,37.6 | 45.8,36 45.8,36.4
  Top 0.4: U2.6 46.05,36.2 46,36 | 44.8,36 44.6,36 43.2,36 L2.P$1 | C13.1 44.8,36 | 44.8,36 45.8,36 46,36 | 46,36 46,38.6 | 44.6,36.6 44.6,37.4 44.6,37.6 44.6,38.6
  Top 0.5: 44.6,37.4 43.8,37.4 | 44.6,36 44,36
  Top 1.2: D1.P$1 45.3,36.6 44.6,36.6 L2.P$1
N$6
  Top 0.3: U3.3 47.95,18.6 R13.2 R12.1
N$7
  Top 0.3: C13.2 44.8,34.2 45.8,34.2 46,34 46,33.75 U2.1
N$8  (via drill 0.4)
  Top 0.2: 9.2,29.55 9.1,29.55 C9.1
  Top 0.3: U1.61 v12.8,28.8 C8.1 | L1.1 9.2,28 v9.2,28.8 9.2,29.55
  Bottom 0.3: v9.2,28.8 v12.8,28.8
N$9
  Top 0.2: 44.8,24.4 44.6,24.4
  Top 0.4: 46,22.85 46,25.4 D2.P$1 44.6,25.4 44.6,24.4 44.6,24.1 43.2,24.1 43.2,23.8 L3.P$1 43.2,22.6 | 43.2,22.6 46,22.6 46,22.85 | 43.2,22.6 43.2,22.3 44.8,22.3 C18.1 | 46,22.85 U3.6
  Top 0.8: L3.P$1 45.8,23.2 | 43.2,23.8 45.8,23.8 | 44.8,24.4 45.8,24.4
N$10
  Top 0.3: C18.2 45.75,20.85 46,20.6 46,20.35 U3.1
N$11
  Top 0.2: R15.2 20.8,37.2 21.4,36.6 LED2.A
N$12
  Top 0.2: R16.2 18.75,39.85 18.8,39.8 21,39.8 21.4,39.4 LED3.A
N$13
  Top 0.2: LED4.A 22,40.8 21.4,41.4 R17.2
N$14
  Top 0.2: IC1.5 71.6,10.5 72.2,11.1 73.8,11.1 73.8,11 U4.4
N$15
  Top 0.2: IC1.4 71.6,10 72.3,9.3 75.1,9.3 75.8,10 75.8,10.65 U4.6
N$16  (via drill 0.4)
  Top 0.2: IC1.8 69.9,12.9 70,13 72.6,13 73.6,12 v73.8,12 74.4,12 74.8,11.6 U4.5
  Bottom 0.3: X1.VBUS 73.2,9.2 73.6,9.6 73.6,11.8 v73.8,12
N$17  (via drill 0.4)
  Top 0.2: R20.2 73.2,8.2 72.3,8.2 v72.1,8 | v64.4,13.6 64.4,13.4 63,12 63,11.86 JP8.2
  Bottom 0.2: v72.1,8 72.1,8.9 70.4,10.6 69.8,10.6 67.4,13 65,13 v64.4,13.6
N$18
  Top 0.2: IC1.26 68.9,7.1 69.8,6.2 R18.2
N$19
  Top 0.2: IC1.9 69.4,13.6 69.6,13.8 69.6,13.95 R21.1
N$20  (via drill 0.4)
  Top 0.2: v73.6,13.8 73.85,13.6 U4.3
  Bottom 0.2: X1.D- 74,9.2 74.6,9.8 74.6,12.8 v73.6,13.8
N$21  (via drill 0.4)
  Top 0.2: v76,13.8 75.75,13.6 U4.1
  Bottom 0.2: X1.D+ 74.8,9.2 75.4,9.8 75.4,13.2 v76,13.8
N$22
  Top 0.2: IC1.11 68.4,13.95 R22.2
N$23
  Bottom 0.2: JP15.2 35.8,42.2 | 35.8,42.2 JP14.1 | JP3.4 35.8,43.6 35.8,42.2
N$24
  Bottom 0.2: JP4.4 35.8,29.6 35.8,31 JP16.2 JP13.1
N$25
  Bottom 0.2: JP19.1 35.8,14.2 | 35.8,14.2 JP20.2 | JP5.4 35.8,15.6 35.8,14.2
N$26
  Bottom 0.2: JP6.4 35.8,1.6 35.8,3 JP18.2 JP17.1
N$27  (via drill 0.4)
  Top 0.2: U5.30 75.35,37.95 75.2,37.8 74.6,37.8 v73.8,37
  Bottom 0.2: v73.8,37 73.8,37.85 R26.1
N$31  (via drill 0.4)
  Top 0.2: U5.11 63.2,29 63.6,29.4 v63.6,30.2
  Bottom 0.2: v63.6,30.2 63.6,29.55 R23.1
N$32  (via drill 0.4)
  Top 0.2: U5.24 v74,29
  Bottom 0.2: R24.2 74,30.2 v74,29
N$33  (via drill 0.4)
  Top 0.2: U5.31 74.7,39.5 v73.8,40.4
  Bottom 0.2: R25.2 73.8,39.4 v73.8,40.4
N$34  (via drill 0.4)
  Top 0.2: LED5.A v62.6,22.8
  Bottom 0.2: v62.6,22.8 62.2,23.4 62.2,30.8 63.2,31.8 72.4,31.8 | 72.4,31.8 72.4,30.25 R24.1 | 72.4,31.8 72.4,37.95 R26.2 72.4,38.05 72.4,39.4 R25.1
PA0.STEP  (via drill 0.4)
  Top 0.2: U1.62 12,25.8 v16.6,21.2
  Bottom 0.2: v16.6,21.2 17,21.6 20.6,21.6 26.6,27.6 26.6,37.4 29.6,40.4 42.8,40.4 45.6,43.2 45.6,43.22 JP3.8
PA1.DIR  (via drill 0.4)
  Top 0.2: U1.63 11.2,26 14.6,22.6 v14.6,22
  Bottom 0.2: v14.6,22 15,22.4 20.2,22.4 25.8,28 25.8,37.8 29.2,41.2 38.2,41.2 38.6,41.6 38.6,43.2 38.2,43.6 38.34,43.62 JP3.5
PA2.EN  (via drill 0.4)
  Top 0.2: U1.64 10.4,26.2 13.6,23 v13.6,21.4
  Bottom 0.2: v13.6,21.4 13.8,21.2 15.4,21.2 16.2,22 20.4,22 26.2,27.8 26.2,37.6 29.4,40.8 40.6,40.8 43,43.2 43.04,43.2 JP3.7
PA3.USM0  (via drill 0.4)
  Top 0.2: U1.1 9.8,25.2 10.6,24.4 10.6,23.6 11.2,23 v11.4,23
  Bottom 0.2: v11.4,23 11.6,23.2 19.8,23.2 25,28.4 25,38.2 30,43.2 30.34,43.2 JP3.2
PA4.USM1  (via drill 0.4)
  Top 0.2: U1.2 9.8,24.4 10.2,24 10.2,23 11.2,22 v12,22
  Bottom 0.2: JP3.3 33.08,43.48 31.6,42 29.4,42 25.4,38 25.4,28.2 20,22.8 12.8,22.8 v12,22
PA5  (via drill 0.4)
  Top 0.2: U1.3 7.6,23.6 7.2,24 v7.2,25.8 | R17.1 16.8,41.4 16.4,41 16.4,39.4 15.4,38.4 4.81,38.4 H2.4
  Bottom 0.2: v7.2,25.8 6.6,26.4 6.6,30.8 6,31.4 6,37.2 4.4,38.8 4.4,38.81 H2.4
PA6.MINX  (via drill 0.4)
  Top 0.2: U1.4 9.8,22.8 11,21.6 11,18 v11.4,17.6 | R9.1 7.65,5.85 6.8,5 5.17,5 H1.4
  Bottom 0.2: H1.4 9.2,9.03 9.2,15.6 11.2,17.6 v11.4,17.6
PA7.MAXX  (via drill 0.4)
  Top 0.2: U1.5 10,22 10.6,21.4 v10.6,15.2 | R7.1 9.25,5.85 7.8,4.4 7.11,4.4 H1.6
  Bottom 0.2: v10.6,15.2 10.4,15 10.4,8.6 6.6,4.8 6.6,3.89 H1.6
PB0
  Top 0.2: U1.6 6.8,21.2 6.4,21.6 6.4,24 4.2,26.2 4.11,26.4 H3.4
PB1
  Top 0.2: U1.7 6.8,20.4 6,21.2 6,23.8 4.4,25.4 2.4,25.4 1.6,26.2 1.6,26.37 H3.3
PB2
  Top 0.2: U1.8 7,19.6 5.6,21 5.6,22.6 4.4,23.8 4.17,23.8 H3.6
PB3
  Top 0.2: U1.9 7.2,18.8 5.2,20.8 5.2,22.2 4.6,22.8 2.6,22.8 1.8,23.6 1.8,23.63 H3.5
PB4/TMS
  Top 0.2: U1.10 7.4,18 4.4,21 4.2,21.23 H3.8
PB5/TDI
  Top 0.2: U1.11 7.6,17.2 4.6,20.2 2.8,20.2 1.8,21.2 1.69,21.2 H3.7
PB6/TCK
  Top 0.2: U1.12 7.8,16.4 5.4,18.8 4.09,18.8 H3.10
PB7/TDO
  Top 0.2: U1.13 8,15.6 5.8,17.8 2.6,17.8 1.8,18.6 1.75,18.6 H3.9
PC0.RTS  (via drill 0.4)  (2 unrouted)
  Top 0.2: U1.16 6,13.2 5.6,13.6 5.6,14.75 H3.12 | IC1.23 67.4,5.6 68.6,4.4 68.74,4.4 JP9.2 | U5.3 63.8,41 65.2,39.6 65.2,27.6 v66,26.8
  Bottom 0.2: JP7.2 65,21.95 65,22.6 65.8,23.4 65.8,26.6 v66,26.8
PC1.CTS  (via drill 0.4)  (2 unrouted)
  Top 0.2: H3.11 2.61,15.2 4.4,15.2 5.2,14.4 5.2,13.4 8,10.6 10.2,10.6 10.4,10.8 U1.17 | JP9.1 69.34,1.8 69.4,1.8 70.3,2.7 70.3,4.7 69.6,5.4 68.2,5.4 67.8,5.8 67.8,7 67.9,7.1 IC1.24 | U5.4 63.9,39.5 64.8,38.6 64.8,26.8 65.8,25.8 v66.6,25.8
  Bottom 0.2: JP7.1 66,20.4 66,22.8 66.6,23.4 v66.6,25.8
PC2.RXD0  (via drill 0.4)  (2 unrouted)
  Top 0.2: U1.18 11.2,10.6 10.8,10.2 7.8,10.2 4.4,13.6 4,13.81 H3.14 | JP9.4 71.71,4.15 71.77,4.2 72,4.4 72,6.2 R18.1 73.2,6.2 | R19.1 73.2,6.2 | R20.1 73.2,6.2 | U5.1 64.8,44 67.2,41.6 67.2,27.6 v68,26.8
  Bottom 0.2: JP7.4 67.8,22.2 67.8,26.6 v68,26.8
PC3.TXD0  (via drill 0.4)  (2 unrouted)
  Top 0.2: U1.19 12,10.6 11.2,9.8 7.6,9.8 4.8,12.6 2.67,12.6 H3.13 | IC1.25 68.4,6.4 v68.6,6.2 | U5.2 62.4,42.4 62.5,42.3 65.9,42.3 66.8,41.4 66.8,26.8 67.8,25.8 v68.6,25.8
  Bottom 0.2: JP9.3 71.61,1.79 70.3,3.1 70.3,4.7 68.8,6.2 v68.6,6.2 66.2,6.2 65,7.4 65,11.8 63.2,13.6 63.2,13.82 JP8.1 | JP7.3 67.33,19.13 68.4,20.2 68.4,25.6 v68.6,25.8
PC4.SS
  Top 0.2: U1.20 12.8,10.6 11.6,9.4 7.4,9.4 5.6,11.2 4,11.2 H3.16
PC5.MOSI
  Top 0.2: U1.21 13.6,10.6 12,9 7.2,9 6.2,10 2.8,10 1.8,11 1.73,11 H3.15
PC6.RXD1.MISO
  Top 0.2: U1.22 14.4,10.6 12.4,8.6 4.2,8.6 3.93,8.8 H3.18
PC7.TXD1.SCK
  Top 0.2: U1.23 15.2,10.6 12.8,8.2 5.2,8.2 4.6,7.6 2.6,7.6 1.8,8.4 1.79,8.4 H3.17
PD0.STEP  (via drill 0.4)
  Top 0.2: U1.26 17.6,10.8 20,8.4 27,8.4 30.8,4.6 v43.2,4.6
  Bottom 0.2: v43.2,4.6 45.98,1.82 JP6.8
PD1.DIR  (via drill 0.4)
  Top 0.2: U1.27 18.4,10.6 20.2,8.8 27.8,8.8 30.6,6 34.2,6 v34.4,5.8
  Bottom 0.2: v34.4,5.8 36,5.8 38.2,3.6 38.2,1.76 JP6.5
PD2.EN  (via drill 0.4)
  Top 0.2: U1.28 19.2,10.4 20.4,9.2 28.6,9.2 30.8,7 38,7 v39.2,5.8
  Bottom 0.2: v39.2,5.8 43.4,1.6 JP6.7
PD3.USM0  (via drill 0.4)
  Top 0.2: U1.29 20,10.2 20.6,9.6 30,9.6 v30.6,9
  Bottom 0.2: v30.6,9 30.6,1.74 JP6.2
PD4.USM1  (via drill 0.4)
  Top 0.2: U1.30 20.8,10.2 21,10 31.4,10 v33.2,8.2
  Bottom 0.2: v33.2,8.2 33.2,1.68 JP6.3
PD5  (via drill 0.4)
  Top 0.2: U1.31 21.6,12.8 v21.4,13 | R14.1 18.4,38.6 17.4,37.6 7.29,37.6 H2.8
  Bottom 0.2: v21.4,13 21.4,19.6 21,20 10.6,20 5.8,24.8 5.8,30.4 5.2,31 5.2,33 4.4,33.8 4.33,33.8 H2.8
PD6.MINY  (via drill 0.4)
  Top 0.2: U1.32 22.4,13.2 21.8,13.8 13.6,13.8 v13,14.4 | R8.1 10.85,5.85 10.85,5.25 9.6,4 9,4 H1.8
  Bottom 0.2: v13,14.4 13.2,14.2 13.2,7.6 9.2,3.6 H1.8
PD7.MAXY  (via drill 0.4)
  Top 0.2: U1.33 23,13.2 22,14.2 15,14.2 v13.8,15.4 | R6.1 12.45,5.85 12.4,5.8 12.4,4.61 H1.10
  Bottom 0.2: v13.8,15.4 13.8,6 11.6,3.8 11.6,3.81 H1.10
PDI  (via drill 0.4)
  Top 0.2: U1.56 16.8,25.4 v17.2,25
  Bottom 0.2: v17.2,25 17.8,25 19.2,26.4 22.4,26.4 24.6,28.6 24.6,43.2 JP1.1
PE0.STEP
  Top 0.2: U1.36 26,15.6 27.6,14 44.4,14 45.6,15.2 45.6,15.22 JP5.8
PE1.DIR
  Top 0.2: U1.37 26.4,16.4 27.2,17.2 36.8,17.2 38,16 38,15.96 JP5.5
PE2.EN
  Top 0.2: U1.38 26.6,17.2 27,17.6 41.4,17.6 43,16 43.04,16 JP5.7
PE3.USM0  (via drill 0.4)
  Top 0.2: U1.39 30,18 30.4,18.4 v30.6,18.4
  Bottom 0.2: v30.6,18.4 30.6,15.74 JP5.2
PE4.USM1  (via drill 0.4)
  Top 0.2: U1.40 28.4,18.8 29.2,19.6 v32,19.6
  Bottom 0.2: v32,19.6 33.2,18.4 33.2,15.68 JP5.3
PE5  (via drill 0.4)
  Top 0.2: U1.41 21,19.6 v20.6,19.2 | R15.1 18.8,37.25 18.8,37.2 7.6,37.2 5.4,35 5.4,33.17 H2.10
  Bottom 0.2: v20.6,19.2 20.2,19.6 10.4,19.6 5.4,24.6 5.4,30.2 4.4,31.2 4.39,31.2 H2.10
PE6.MINZ  (via drill 0.4)
  Top 0.2: U1.42 23.2,20.4 22.8,20 20.2,20 19.8,19.6 19.8,16.8 18.8,15.8 v15.4,15.8 | R5.1 14.2,3.87 H1.12
  Bottom 0.2: v15.4,15.8 15.8,15.4 15.8,5.2 14.6,4 14.33,4 H1.12
PE7.MAXZ  (via drill 0.4)
  Top 0.2: v16.4,16.6 16.8,16.2 18.6,16.2 19.4,17 19.4,20 19.8,20.4 22.6,20.4 23.4,21.2 U1.43 | R4.1 15.8,4.6 16.2,4.2 16.2,4.15 H1.14
  Bottom 0.2: H1.14 16.61,3.79 16.2,4.2 16.2,16.4 v16.4,16.6
PF0.STEP
  Top 0.2: U1.46 25.2,23.6 26,24.4 30.4,24.4 32.4,26.4 33.6,26.4 34.8,27.6 44,27.6 45.98,29.58 JP4.8
PF1.DIR  (via drill 0.4)
  Top 0.2: U1.47 25.4,24.4 25.8,24.8 30.2,24.8 32.6,27.2 v33.2,27.2
  Bottom 0.2: v33.2,27.2 34.2,28.2 37,28.2 38,29.2 38,29.24 JP4.5
PF2.EN
  Top 0.2: U1.48 30,25.2 32.8,28 41.8,28 43.4,29.6 JP4.7
PF3.USM0
  Top 0.2: U1.49 22.4,27.6 28.8,27.6 30.6,29.4 30.6,29.46 JP4.2
PF4.USM1
  Top 0.2: U1.50 21.6,26 21.8,25.8 22.8,25.8 24.2,27.2 30.6,27.2 33,29.6 33.2,29.52 JP4.3
PF5  (via drill 0.4)
  Top 0.2: U1.51 v20.8,25.4 | R16.1 17.25,39.65 15.6,38 5.15,38 H2.6
  Bottom 0.2: v20.8,25.4 20.8,25.2 19.4,23.8 7.4,23.8 6.2,25 6.2,30.6 5.6,31.2 5.6,35.2 4.4,36.4 4.27,36.4 H2.6
PF6.MINA  (via drill 0.4)
  Top 0.2: U1.54 18.4,18 v17.8,17.4 | R3.1 17.4,5.4 19.06,3.74 H1.16
  Bottom 0.2: v17.8,17.4 19,16.2 19,4.2 19.15,4.05 H1.16
PF7.MAXA  (via drill 0.4)
  Top 0.2: U1.55 17.6,25.8 18,25.4 18,19.2 v17.2,18.4 | R2.1 19.15,5.85 20.4,4.6 21,4.6 21.4,4.2 21.4,4.03 H1.18
  Bottom 0.2: v17.2,18.4 18.4,18.4 19.8,17 19.8,7.2 21.4,5.6 21.4,4.2 21.69,3.91 H1.18
RST/PDC  (via drill 0.4)
  Top 0.2: U1.57 16,27.8 16.45,28.25 R1.2 16.45,28.95 16.4,29 v17.2,29.8
  Bottom 0.2: v17.2,29.8 17.6,30.2 22.8,30.2 24.2,31.6 24.2,41 23.2,42 19.4,42 | 19.4,42 13.91,42 SW1.1 | JP1.3 19.4,43.6 19.4,42
VIN  (via drill 0.4)
  Top 0.2: C22.1 v52.2,23
  Top 0.4: C17.1 51.1,36.2 51,36.3 49.2,36.3 C16.1 47.95,36.35 | 47.95,36.35 U2.4 | 47.95,36.35 47,36.35 | U2.5 47,36.35 | 47,36.35 47,36.4 | 47,36.4 47,36.6 50.4,36.6 | 47,36.4 v52.2,36.4 | C22.1 50.6,23.2 47,23.2 U3.5 U3.4 49.2,22.9 C21.1 49.2,23 50.4,23
  Bottom 0.4: 53.2,24 v52.2,23 53.2,22 | 53.2,37.4 v52.2,36.4 53.2,35.4
  Bottom 1.2: v52.2,36.4 53.6,36.4 | 53.6,36.4 JP3.11 | 53.6,36.4 JP4.11 53.6,23 | 53.6,23 JP5.11 JP6.11 | v52.2,23 53.6,23

### Text on the board
Reference: GND | RST/PDC | 3.3V | PDI | GND | +5V | GND | PA5 | GND | PF5 | GND | PD5 | GND | PE5 | +5V | 3.3V | PB1 | PB0 | PB3 | PB2 | PB5 | PB4 | PB7 | PB6 | CTS.PC1 | PC0.RTS | TXD0.PC3 | PC2.RXD0 | PC5 | PC4 | TXD1.PC7 | PC6.RXD1 | GND | 3.3V | 3.3V | PA6.MINX | PA7.MAXX | PD6.MINY | PD7.MAXY | PE6.MINZ | PE7.MAXZ | PF6.MINA | PF7.MAXA | 3.3V | 3.3V | GND | GND | GND | GND | GND | GND | GND | GND | GND